# EAGLE design POE Injector (EAGLE 8.2.2)
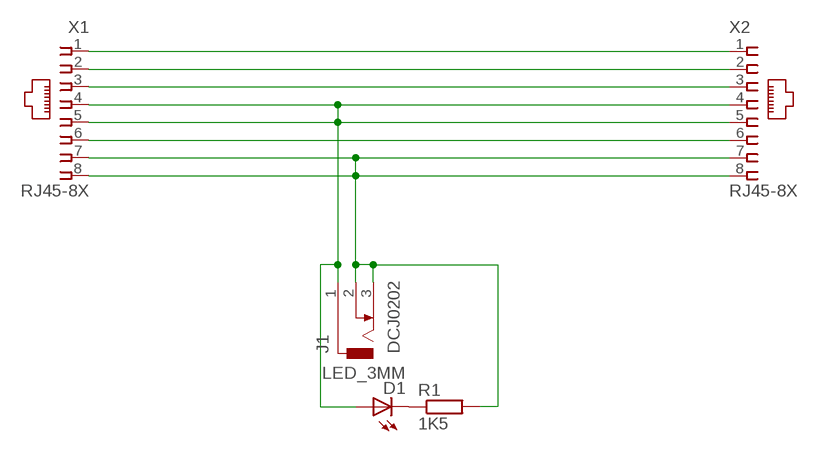
[diagram p0: schematic, sheet 1]

## Parts
D1  LED_3MM  [LED3MM]
J1  DCJ0202  [DCJ0202]
R1  1K5  R_1206  [R1206]
X1  RJ45-8X  [RJ45-NO-SHIELD]
X2  RJ45-8X  [RJ45-NO-SHIELD]

## Nets
N$1: X1.1 X2.1
N$2: X1.2 X2.2
N$3: X1.3 X2.3
N$4: X1.6 X2.6
N$5: J1.2 J1.3 R1.2 X1.7 X1.8 X2.7 X2.8
N$7: D1.A J1.1 X1.4 X1.5 X2.4 X2.5
N$8: D1.K(C) R1.1

## Library data of the parts
D1 = Namenlos:LED_
J1 = con-jack:DCJ0202: DC POWER JACK Source: DCJ0202.pdf; OC_FARNELL: unknown; OC_NEWARK: unknown
R1 = Namenlos:R_
X1 X2 = con-tycoelectronics:RJ45: CORCOM Modular RJ Jacks No Shield Source: www.tycoelectronics.com .. ENG_DS_1654001_1099_RJ_L_0507.pdf; MPN: RJ45-8X; OC_FARNELL: unknown; OC_NEWARK: 16R6101

## Board
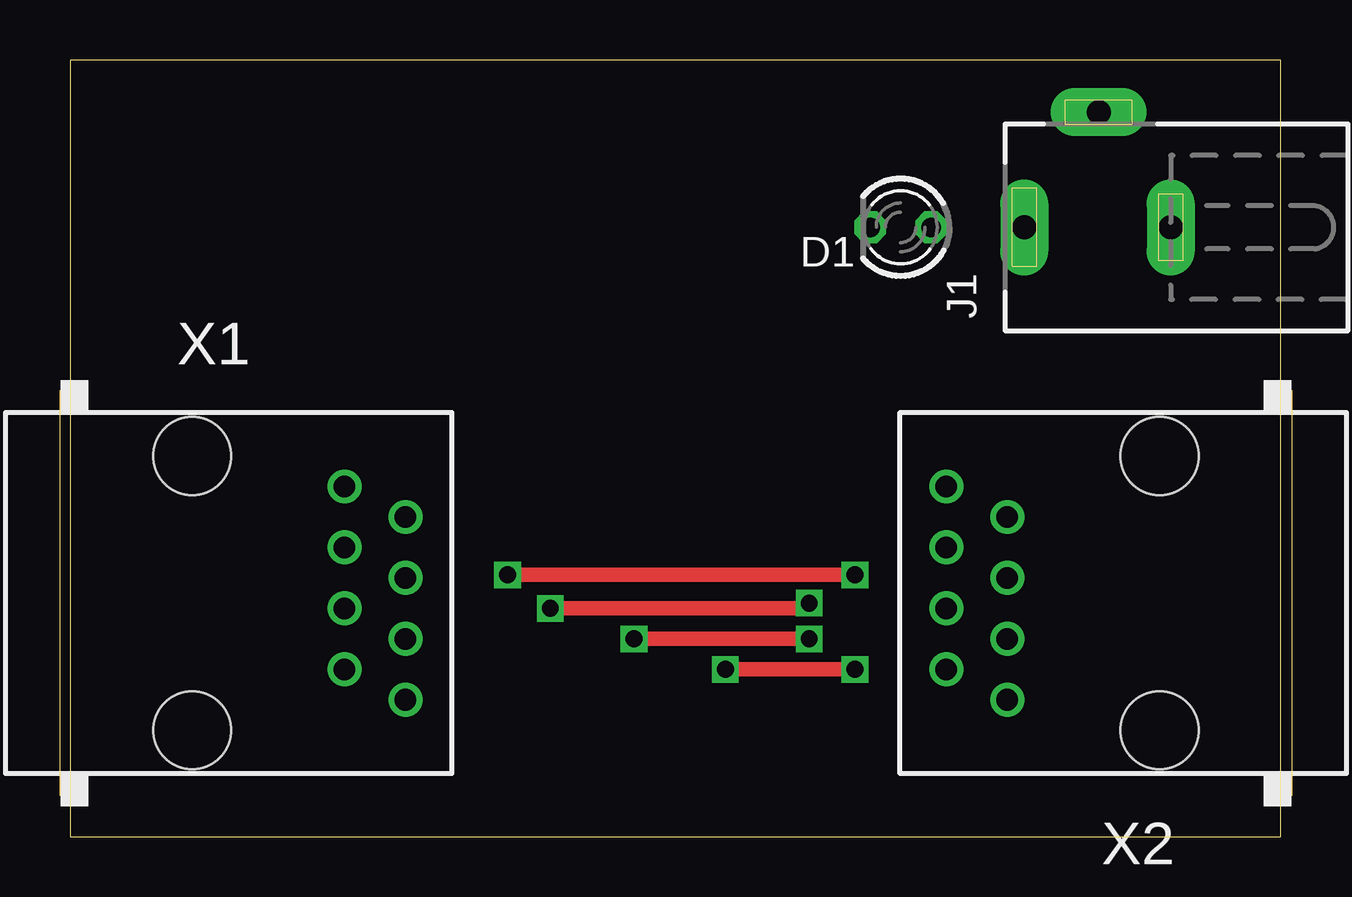
[diagram p1: board, top side]
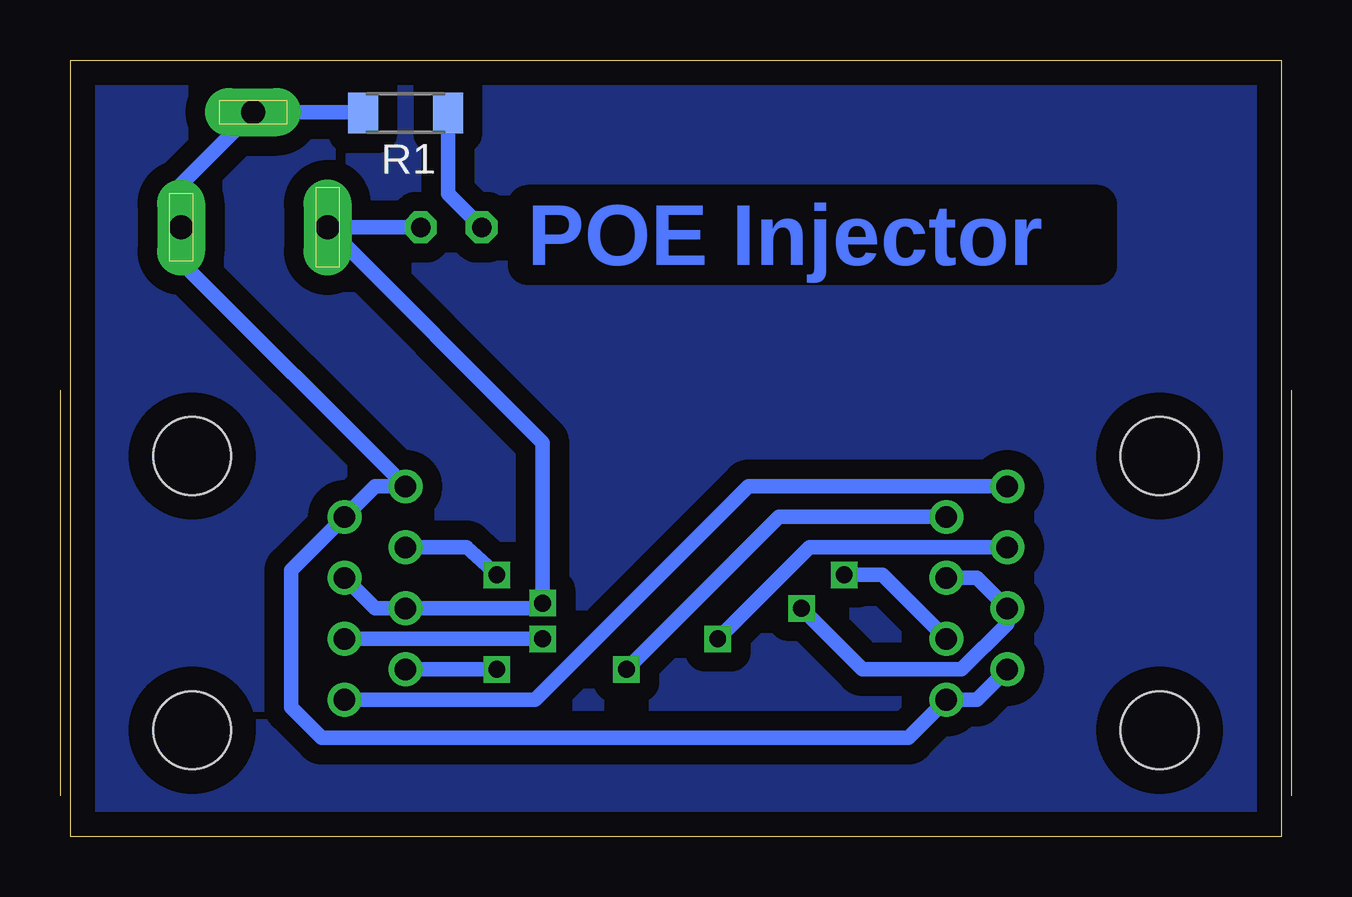
[diagram p2: board, bottom side, seen from below]

Size 50.46 x 32.37 mm. Coordinates in mm from the lower left corner, seen from the top.
Outline: 0,0 50.46,0 50.46,32.37 0,32.37 0,0
Copper layers (1*16): Top 0.035mm / dielectric 1.5mm / Bottom 0.035mm
Design rules "default": minimum track width 6mil, minimum drill 0.35mm, track to track 6mil, track to pad 6mil, pad to pad 6mil, via to via 6mil, smd to smd 6mil, copper to edge 40mil, drill to drill 6mil, minimum pad ring 10mil, minimum via ring 8mil, stop-mask expansion 4mil, vias tented up to drill 0mil, thermal gap 10mil

### Footprints (pad centres in the part's own frame; a part is rotated, then mirrored left to right if it is on the bottom)
LED3MM = drill 0.813 octagon: A -1.27,0; K 1.27,0
DCJ0202 = drill 1 pad 2 long: 1 0,3.1; 2 4.8,0; 3 0,-3
R1206 = smd 1.25 x 1.7: 1 -1.775,0; 2 1.775,0
RJ45-NO-SHIELD = drill 0.9 pad 1.4: 1 -4.445,6.35; 2 -3.175,8.89; 3 -1.905,6.35; 4 -0.635,8.89; 5 0.635,6.35; 6 1.905,8.89; 7 3.175,6.35; 8 4.445,8.89 | hole 3.251: -5.715,0; 5.715,0

### Placement (x,y rotation side)
D1  34.61,25.4 180 top
J1  42.86,25.4 90 top
R1  36.51,30.16 180 bottom
X1  5.08,10.16 270 top
X2  45.4,10.16 90 top

### Tracks (layer width: path | path; a pad name or v marks a point on that pad's centre or on a via)
N$1
  Bottom 0.61: X1.1 22.23,14.61 31.11,5.71 X2.1
N$2  (via drill 0.7)
  Top 0.61: v27.3,6.99 v32.7,6.99
  Bottom 0.61: X1.2 20.95,13.34 v27.3,6.99 | v32.7,6.99 X2.2
N$3  (via drill 0.7)
  Top 0.61: v23.5,8.26 v30.8,8.26
  Bottom 0.61: X1.3 19.68,12.06 v23.5,8.26 | v30.8,8.26 X2.3
N$4  (via drill 0.7)
  Top 0.61: v18.22,10.92 v32.7,10.92
  Bottom 0.61: v32.7,10.92 33.97,12.06 X2.6 | v18.22,10.92 16.64,10.92 X1.6
N$5
  Bottom 0.61: X1.7 12.7,5.71 X1.8 15.56,4.13 40.01,4.13 41.27,5.4 41.27,11.11 X2.7 37.78,14.61 X2.8 45.86,23.95 J1.3 45.86,27.2 J1.2 38.33,30.2 R1.2
N$6
  pour Bottom (isolate 0.813): 0,32.38 50.48,32.38 50.48,0 0,0
N$7  (via drill 0.7)
  Top 0.61: v20,9.53 30.58,9.53 v30.8,9.74
  Bottom 0.61: X1.4 12.7,10.79 X1.5 11.43,8.89 13.34,6.99 17.46,6.99 v20,9.53 | X2.5 37.78,9.53 X2.4 31.02,9.53 v30.8,9.74 30.8,16.43 J1.1 D1.A
N$8
  Bottom 0.61: D1.K 34.74,26.8 R1.1

### Text on the board
Bottom: POE Injector